# Altium project Mini_Piano_V1.0.PrjPcb
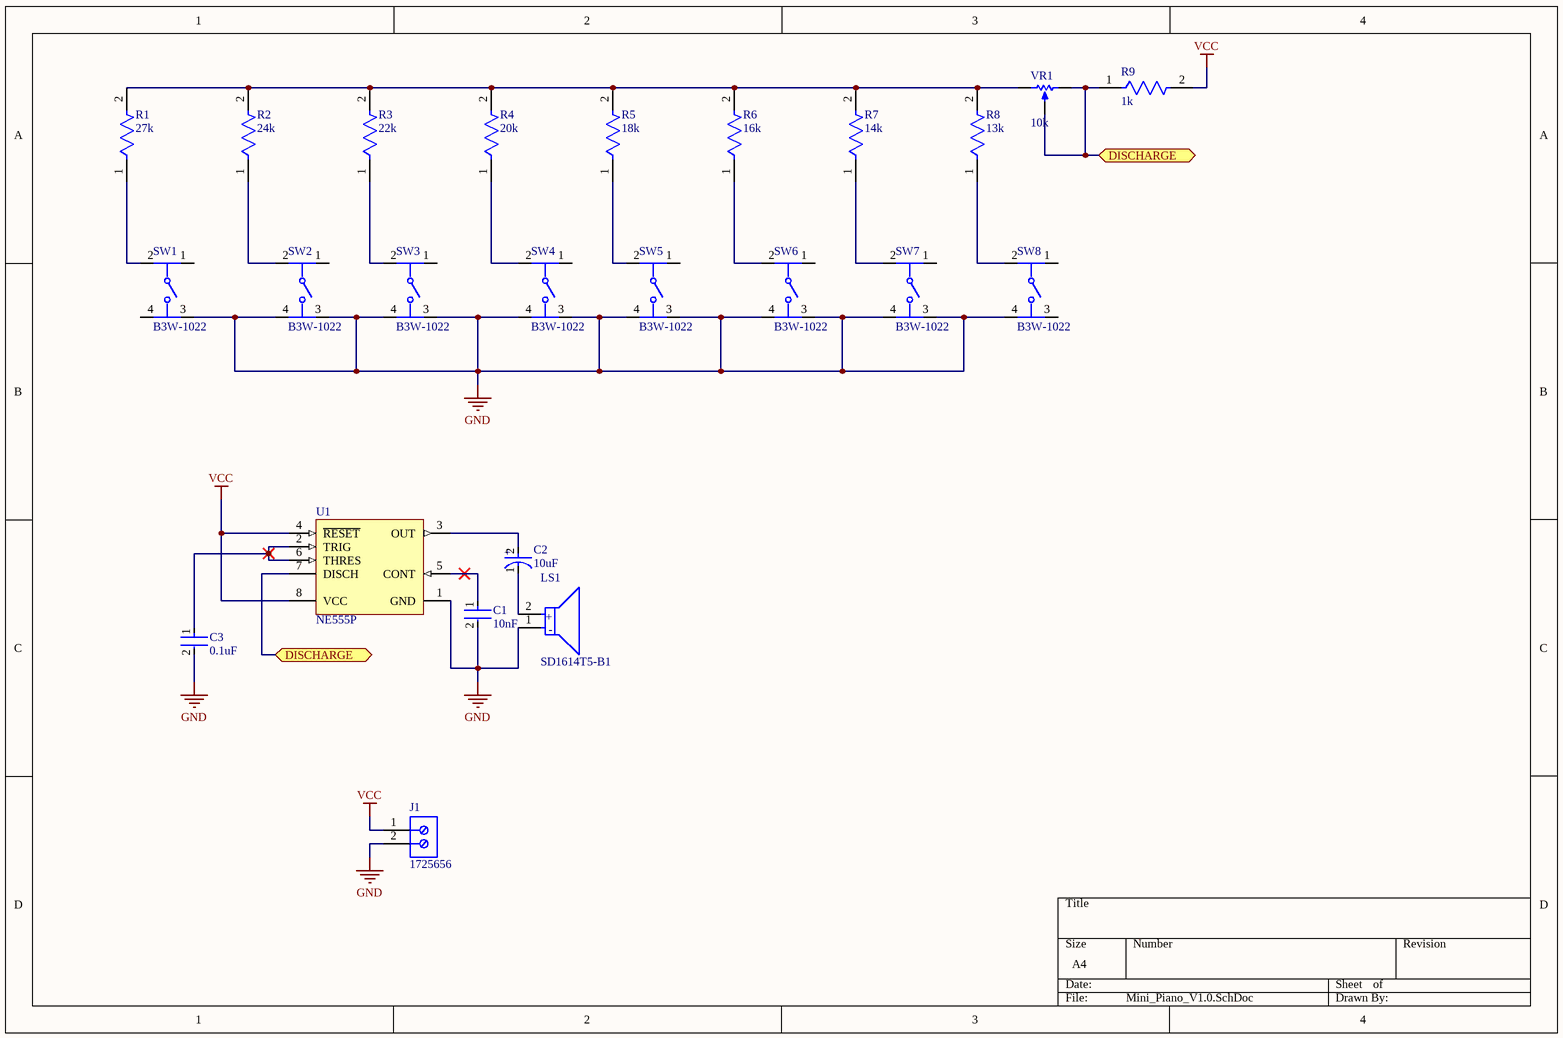
[diagram p0: Mini_Piano_V1.0.SchDoc]
1 sheet, 24 parts. Net scope: flat (ports and power ports of the same name join across sheets).
Board file: Mini_Piano_V1.0.PcbDoc

## Sheet Mini_Piano_V1.0.SchDoc
size A4; SheetNumber: 1; SheetTotal: 1

### Parts
C1  10nF  [FP-K221K15X7RF5TL2-MFG]
C2  10uF  [FP-RAD-TH-D_5_0_5-L_7_1-F-MFG]
C3  0.1uF  [FP-K221K15X7RF5TL2-MFG]
J1  1725656  [PHOE-1725656-2]
LS1  SD1614T5-B1  [FP-SD1614T5-B1-MFG]
R1  27k  [FP-MFR-12-MFG]
R2  24k  [FP-MFR-12-MFG]
R3  22k  [FP-MFR-12-MFG]
R4  20k  [FP-MFR-12-MFG]
R5  18k  [FP-MFR-12-MFG]
R6  16k  [FP-MFR-12-MFG]
R7  14k  [FP-MFR-12-MFG]
R8  13k  [FP-MFR-12-MFG]
R9  1k  [FP-MFR-12-MFG]
SW1  B3W-1022  [FP-B3W-1022-MFG]
SW2  B3W-1022  [FP-B3W-1022-MFG]
SW3  B3W-1022  [FP-B3W-1022-MFG]
SW4  B3W-1022  [FP-B3W-1022-MFG]
SW5  B3W-1022  [FP-B3W-1022-MFG]
SW6  B3W-1022  [FP-B3W-1022-MFG]
SW7  B3W-1022  [FP-B3W-1022-MFG]
SW8  B3W-1022  [FP-B3W-1022-MFG]
U1  NE555P  [P0008A]
VR1  10k  [VISH-M63P103KB30T607]

### Ports
DISCHARGE (bidir, see Mini_Piano_V1.0[1C]), DISCHARGE (bidir, see Mini_Piano_V1.0[3A])

### Nets
GND: C1.2 C3.2 J1.2 LS1.1(C) SW1.3 SW2.3 SW2.4 SW3.3 SW3.4 SW4.3 SW4.4 SW5.3 SW5.4 SW6.3 SW6.4 SW7.3 SW7.4 SW8.4 U1.1(GND)
VCC: J1.1 R9.2 U1.4(~{RESET}) U1.8(VCC)
NetC1_1: C1.1 U1.5(CONT)
NetC2_1: C2.1(C) LS1.2(A)
NetC2_2: C2.2(A) U1.3(OUT)
NetC3_1: C3.1 U1.2(TRIG) U1.6(THRES)
NetR1_1: R1.1 SW1.2
NetR1_2: R1.2 R2.2 R3.2 R4.2 R5.2 R6.2 R7.2 R8.2 VR1.1(CCW)
NetR2_1: R2.1 SW2.2
NetR3_1: R3.1 SW3.2
NetR4_1: R4.1 SW4.2
NetR5_1: R5.1 SW5.2
NetR6_1: R6.1 SW6.2
NetR7_1: R7.1 SW7.2
NetR8_1: R8.1 SW8.2
NetR9_1: R9.1 U1.7(DISCH) VR1.2(S) VR1.3(CW) ; port DISCHARGE

Not connected (* = marked no-connect by the designer): SW1 1 4; SW2 1; SW3 1; SW4 1; SW5 1; SW6 1; SW7 1; SW8 1 3

### Notes on the sheet
- (in symbol CMP-05427-000251-1) +
- (in symbol CMP-08413-000012-1) +; -

### Library data of the parts
C1 C3 = CMP-00030-39474895-1: K221K15X7RF5TL2 Multilayer Ceramic Capacitor, 220 pF, 50 V, ± 10%, X7R, Radial Leaded; Voltage Rating (DC): 50V; Lead Diameter: 500µm; Lead Length: 30mm; Lead/Base Style: Straight; Capacitance: 220pF; REACH SVHC: Unknown; Tolerance: 10%; Radiation Hardening: No; Depth: 2.6mm; Packaging: Cut Tape; Dielectric Material: Ceramic; Height: 4mm; Dielectric: X7R; Thickness: 2.6mm; Max Operating Temperature: 125°C; Weight: 160.004709mg; Height - Seated (Max): 5.588mm; Length: 4mm; Min Operating Temperature: -55°C; Case/Package: Dipped; Mount: Through Hole; Width: 2.4892mm; Number of Pins: 2; Diameter: 500µm; Voltage Rating: 50V; Termination: Radial; NexarPartId: 39474895; Lead Pitch: 2.5mm; RoHS: Compliant
C2 = CMP-05427-000251-1: Aluminum Electrolytic Capacitors (Radial Lead Type) 22uF ±20% 16V; Ripple Current: 50mA; Leakage Current: 3.5uA; Polarity: Polar; Life (Hours): 1000Hour; Lead Diameter: 0.45mm; Package Quantity: 200; Termination: Radial; Series: GA; Diameter: 5mm; Lead Pitch: 2mm; Height - Seated (Max): 0.276inch; Voltage Rating (DC): 16V; Case/Package: Radial; Packaging: Bulk; Capacitance: 22uF; Mount: Through Hole; REACH SVHC: No SVHC; Radiation Hardening: No; Min Operating Temperature: -55°C; Ripple Current (AC): 50mA; Length: 7mm; Max Operating Temperature: 105°C; Construction: RADIAL; RoHS Compliant: Yes; Voltage: 16V; Voltage Rating: 16V; Height: 7mm; Tolerance: 20%
J1 = CMP-2000-05299-1: Male Header, Pitch 2.54 mm, 1 x 2 Position, Height 9 mm, Tail Length 3.5 mm; Manufacturer: Phoenix Contact; Number of contacts: 2; Content: 250pc(s); Pitch: 2.54mm; Industrial packaging: Yes; Colour: Green; Manufacturer part No.: 1725656; Type: MPT0,5/2-2,54; Datasheet URL: http://datasheet.octopart.com/1725656-Phoenix-Contact-datasheet-5302866.pdf; Manufacturer URL: http://www.phoenixcontact.com/; Datasheet Version: Apr-08
LS1 = CMP-08413-000012-1: AUDIO MAGNETIC XDCR 3-6V TH; Voltage Rating (DC): 5V; Frequency: 2.048kHz; Number of Terminals/Pins: 2; Max Supply Current: 80mA; Self Resonant Frequency: 2.05kHz; Washable: No; Diameter: 16mm; Package Quantity: 480; Min Operating Temperature: -10°C; Termination: PC Pins; Mount: Through Hole; Packaging: Tray; Height: 14mm; Series: SD; Operating Supply Current: 80mA; Operating Supply Voltage: 5V; Max Operating Temperature: 70°C; Number of Pins: 2; Sensing Method: Magnetic
R1-R9 = CMP-03413-000012-1: RES MF 1/6W 1% AXIAL; Power Rating: 160mW; Voltage Rating (DC): 200V; Resistance: 10kR; Min Operating Temperature: -55°C; Max Operating Temperature: 155°C; Voltage Rating: 200V; Termination: Axial; Packaging: Ammo Pack; Tolerance: 1%
SW1-SW8 = CMP-08834-000055-1: SWITCH TACTILE SPST-NO 0.05A 24V; Operating Force: 230gf; Switch Function: Off-Mom; Switch Travel: 0.25mm; Throw Configuration: SPST; Actuator Type: Standard; Illumination Type: Non-Illuminated; Ratings: IP67; Mechanical Life: 1000000Cycles; Packaging: Bulk; Termination: PC Pin; Max Operating Temperature: 70°C; RoHS Compliant: Yes; Mount: Through Hole; Min Operating Temperature: -25°C
U1 = CMP-2000-04954-1: Precision Timer, 4.5 to 16 V, 0 to 70 degC, 8-Pin DIP, Pb-Free, Tube; Manufacturer: TexasInstruments; Maximum High Level Output Current: -200mA; Number of Internal Timers: 1; Operating Supply Voltage: 5; Maximum Low Level Output Current: 200mA; Rad Hard: No; Packaging: Rail/Tube; Manufacturer URL: http://www.ti.com/; Package Reference: P8; Package Description: 8-Pin Double In-line Package, Body 9.59 x 6.35 mm, Pitch 2.54 mm; Package URL: http://www.ti.com/lit/ml/mpdi001b/mpdi001b.pdf; Type: Standard; Datasheet URL: http://www.ti.com/general/docs/lit/getliterature.tsp?genericPartNumber=NE555&fileType=pdf; Category: Timer; Package: 8PDIP; Datasheet Version: Rev. I, 09/2014
VR1 = CMP-1666-00012-6: Single-Turn Cermet Trimmer, 10 KOhm, -55 to 125 degC, 3-Pin THD, RoHS, Bulk; Manufacturer: Vishay Semiconductor; Mounting Technology: Through Hole; DatasheetVersion: 09/2015; ComponentLink2Description: Datasheet; ComponentLink1Description: Manufacturer URL; ComponentLink1URL: http://www.vishay.com/; ComponentLink2URL: http://120.52.73.14/www.mouser.com/ds/2/427/63-239923.pdf; PackageDescription: 3-Pin Through Hole Device, Body 9.52 x 9.52 mm, Pitch 2.54 mm; PackageReference: M63P103KB30T607